# EasyEDA Pro project ProPrj_电容计量V2_2026-06-24.epro, schematic Schematic16_2
Board Name: Board1; Create Date: 2026-01-06; Page Name: P1; Project Name: 电容计量1; Schematic Name: Schematic5; Update Date: 2026-01-06; Page Size: A4; Version: V1.0
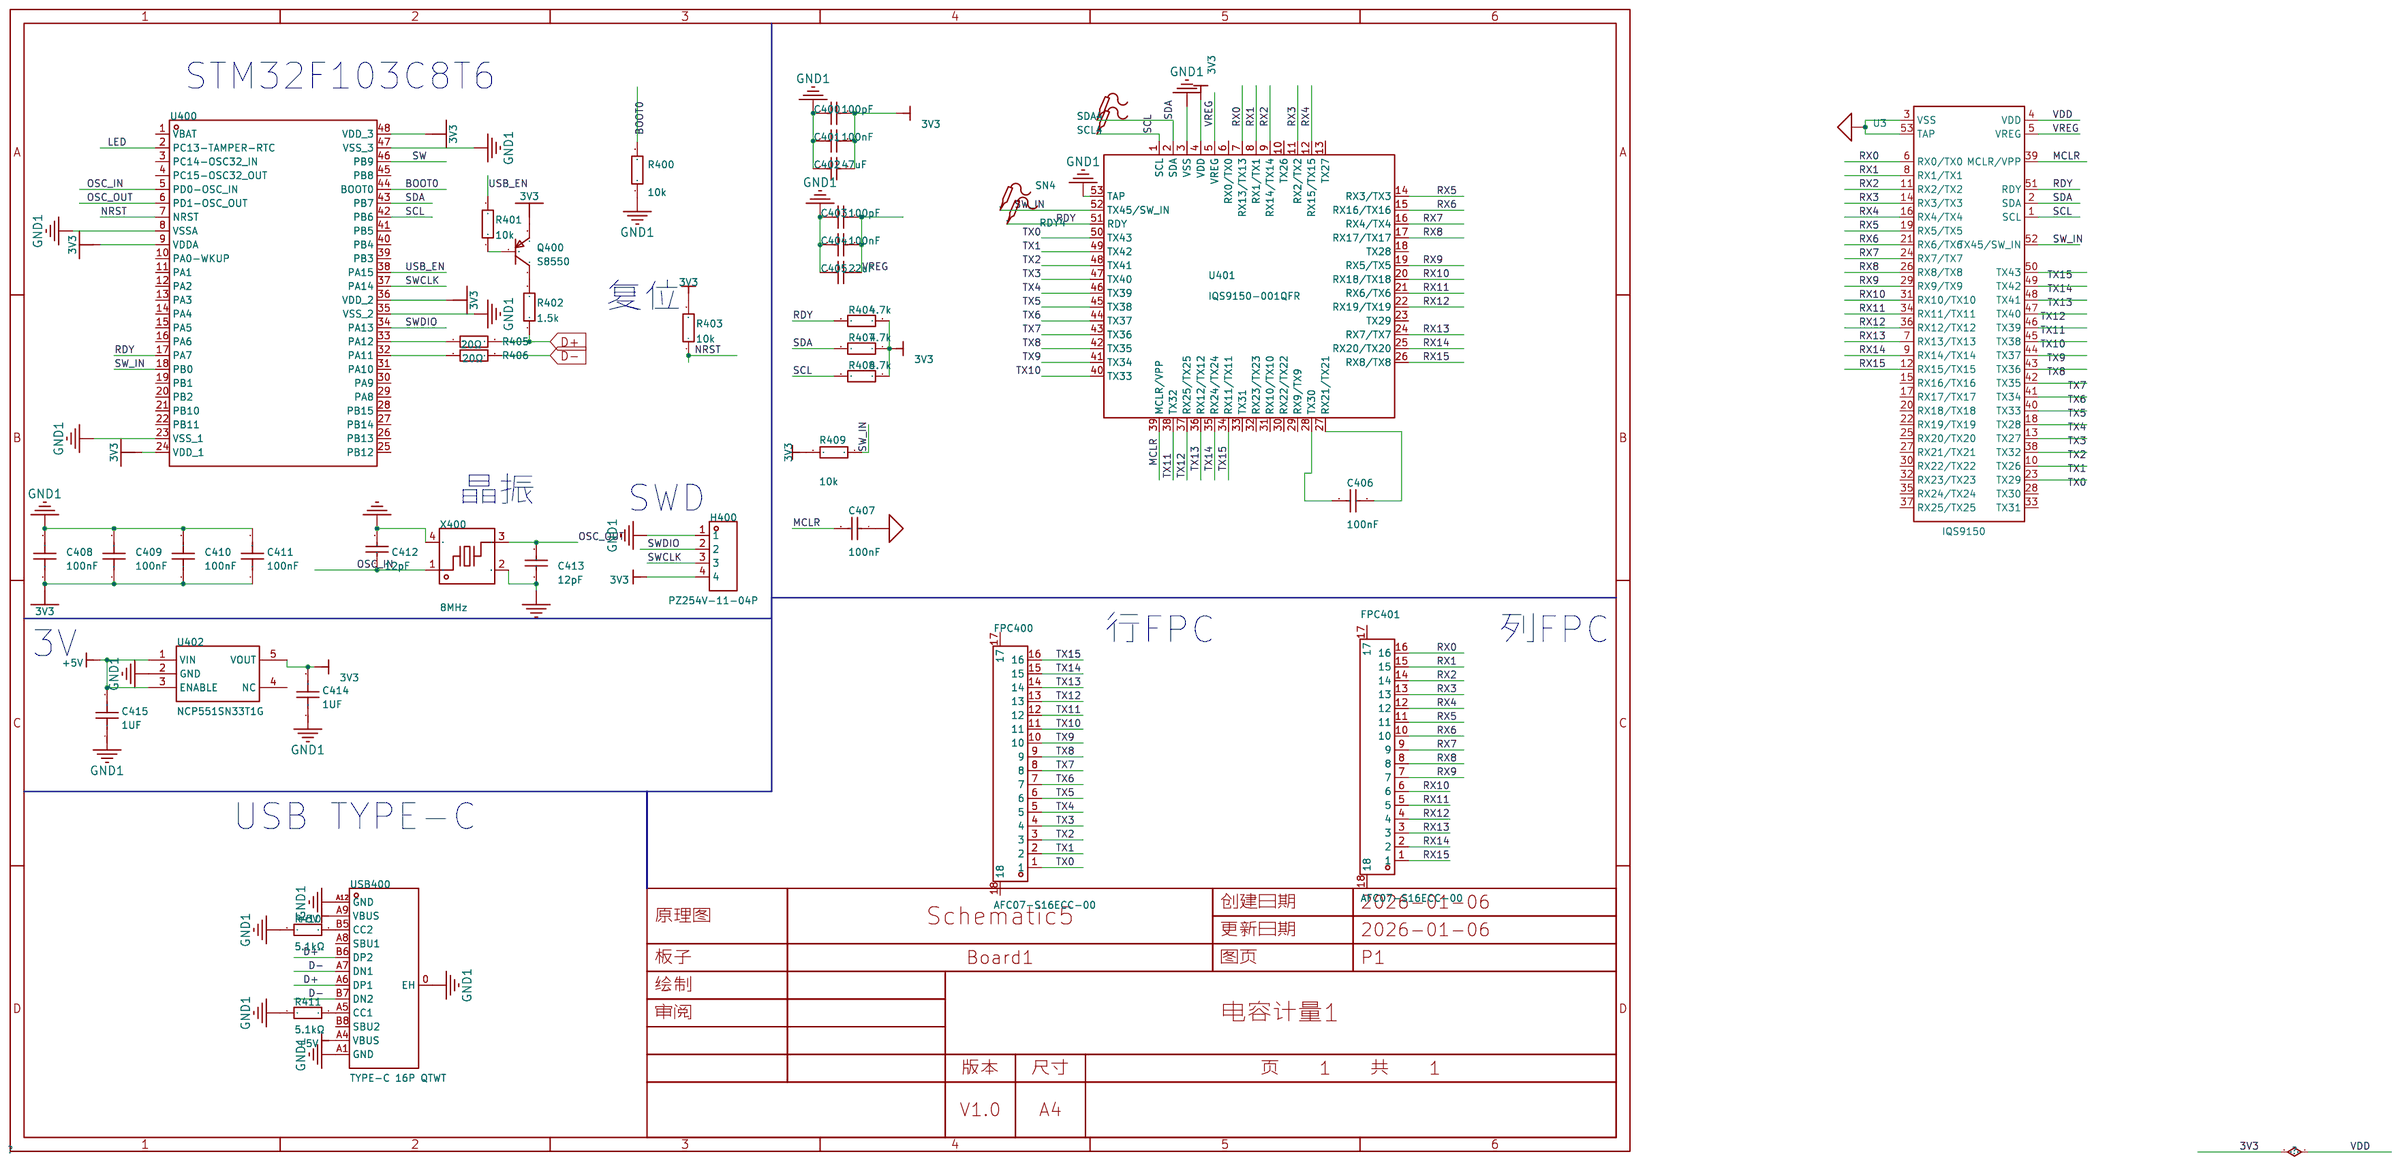
[diagram p6: schematic sheet]

## Parts
C400  100pF  [C0402]
C401  100nF  [C0402]
C402  47uF  [C0402]
C403  100pF  [C0402]
C404  100nF  [C0402]
C405  22uF  [C0402]
C406  100nF  [C0402]
C407  100nF  [C0402]
C408  100nF  [C0402]
C409  100nF  [C0402]
C410  100nF  [C0402]
C411  100nF  [C0402]
C412  12pF  [C0402]
C413  12pF  [C0402]
C414  1UF  [C0402]
C415  1UF  [C0402]
FPC400  AFC07-S16ECC-00  [FPC-SMD_16P-P0.50_AFC07-S16ECC-00]
FPC401  AFC07-S16ECC-00  [FPC-SMD_16P-P0.50_AFC07-S16ECC-00]
H400  PZ254V-11-04P  [HDR-TH_4P-P2.54-V-M]
Q400  S8550  [SOT-23-3_L2.9-W1.3-P1.90-LS2.4-BR]
R400  10k  [R0402]
R401  10k  [R0402]
R402  1.5k  [R0402]
R403  10k  [R0402]
R404  4.7k  [R0402]
R405  20Ω  [R0402]
R406  20Ω  [R0402]
R407  4.7k  [R0402]
R408  4.7k  [R0402]
R409  10k  [R0402]
R410  5.1kΩ  [R0402]
R411  5.1kΩ  [R0402]
RDY4  -  [Test-Point-0.5mm]
SCL4  -  [Test-Point-0.5mm]
SDA4  -  [Test-Point-0.5mm]
SN4  -  [Test-Point-0.5mm]
U3  IQS9150  [QFN1-52_L6.0-W6.0-P0.40-TL-EP4.5]
U400  -  [LQFP-48_L7.0-W7.0-P0.50-LS9.0-BL]
U401  IQS9150-001QFR  [QFN1-52_L6.0-W6.0-P0.40-TL-EP4.5]
U402  NCP551SN33T1G  [SOT-23-5_L3.0-W1.7-P0.95-LS2.8-BR]
USB400  TYPE-C 16P QTWT  [USB-TYPE-C-SMD_TYPE-C-16P-QTWT]
X400  8MHz  [CRYSTAL-SMD_4P-L3.2-W2.5-BL-1]

## Library data of the parts
C400-C407 C412 C413 = GCM1555C1H120FA16D: 容值:12pF;精度:±1%;额定电压:50V;材质(温度系数):C0G;; LCSC Part Name: 12pF ±1% 50V; Supplier Part: C393682; Manufacturer: muRata(村田); Supplier Footprint: 0402; JLCPCB Part Class: Extended Part; Datasheet: https://atta.szlcsc.com/upload/public/pdf/source/20190516/C393682_2405B7553F1D74F0F214F12B2CF6E34B.pdf; Supplier: LCSC; Tolerance: ±1%; Voltage Rated: 50V; Temperature Coefficient: C0G
C408-C411 C414 C415 = CC0402KRX7R7BB104: 容值:100nF;精度:±10%;额定电压:16V;温度系数:X7R;; LCSC Part Name: 100nF ±10% 16V; Supplier Part: C60474; Manufacturer: YAGEO(国巨); Supplier Footprint: 0402; JLCPCB Part Class: Extended Part; Datasheet: https://atta.szlcsc.com/upload/public/pdf/source/20211223/9278FD768280B81DDBEF48FA36411A03.pdf; Supplier: LCSC; Tolerance: ±10%; Voltage Rated: 16V; Temperature Coefficient: X7R
FPC400 FPC401 = AFC07-S16ECC-00: 锁定特性:抽屉式;触点类型:上接;触点数量:16P;间距:0.5mm;安装方式:卧贴;工作温度:-25℃~+85℃;; LCSC Part Name: 抽屉式 上接 P数:16P 间距:0.5mm; Supplier Part: C11088; Manufacturer: JS(钜硕电子); Supplier Footprint: SMD,P=0.5mm,卧贴; JLCPCB Part Class: Extended Part; Datasheet: https://item.szlcsc.com/datasheet/AFC07-S16ECC-00/11635.html; Supplier: LCSC; Locking Feature: 抽屉式; Contact Type: 上接; Number of Contacts: 16P; Pitch: 0.5mm; Mounting Type: 卧贴; FFC, FCB Thickness: 0.3mm; Height Above Board: 2mm; Contact Material: 磷青铜; Contact Plating: 锡; Operating Temperature: -25℃~+85℃; Rated Voltage (Max): 50V; Current Rating (Max): 400mA
H400 = PZ254V-11-04P: 插针结构:1x4P;间距:2.54mm;行距:-;圆针/方针:方针;安装方式:直插;排数:单排;总PIN位数:4P;额定电流:3A;额定电压:250V;配合针长度:6mm;塑高:2.5mm;端接针长度:3mm;触头材质:-;工作温度:-40℃~+105℃;颜色:黑色;; LCSC Part Name: 1x4P 间距:2.54mm 方针 直插; Supplier Part: C2691448; Manufacturer: XFCN(兴飞); Supplier Footprint: 插件,P=2.54mm; JLCPCB Part Class: 扩展库; Datasheet: https://item.szlcsc.com/datasheet/PZ254V-11-04P/2801085.html; Supplier: LCSC; Pin Structure: 1x4P; Pitch: 2.54mm; Circluar Pins/Square Pins: 方针; Mounting Type: 直插; Number of Rows: 单排; Number of Pins: 4P; Current Rating: 3A; Voltage Rating (Max): 250V; Length of Mating Pin: 6mm; Insulation Height: 2.5mm; Length of End Connection Pin: 3mm; Operating Temperature: -40℃~+105℃; Color: 黑色
Q400 = S8550: LCSC Part Name: PNP -25V -500mA 120-400 SOT-23; Supplier Part: C2931720; Manufacturer: Doeshare(德芯); Supplier Footprint: SOT-23; JLCPCB Part Class: 扩展库; Datasheet: https://atta.szlcsc.com/upload/public/pdf/source/20220104/15A23F6542E365B9E2BA018BE45092B6.pdf; Supplier: LCSC
R400-R404 R407-R409 = 0603WAF1002T5E: LCSC Part Name: 10KΩ(1002) ±1% 编带; Supplier Part: C25804; Manufacturer: UNI-ROYAL(厚声); Supplier Footprint: 0603; JLCPCB Part Class: Basic Part; Datasheet: https://atta.szlcsc.com/upload/public/pdf/source/20170920/C25804_1505901551523983377.pdf; Supplier: LCSC
R405 R406 = 0402WGJ0102TCE: 电阻类型:厚膜电阻;阻值:1kΩ;精度:±5%;功率:1/16W;温度系数:±100ppm/℃;最大工作电压:50V;工作温度范围:-55℃~+155℃;; LCSC Part Name: 1kΩ ±5%; Supplier Part: C25543; Manufacturer: UNI-ROYAL(厚声); Supplier Footprint: 0402; JLCPCB Part Class: Extended Part; Datasheet: https://atta.szlcsc.com/upload/public/pdf/source/20200306/C422600_1E6D84923E4A46A82E41ADD87F860B5C.pdf; Supplier: LCSC; Type: 厚膜电阻; Tolerance: ±5%; Power(Watts): 1/16W; Temperature Coefficient: ±100ppm/℃; Overload Voltage (Max): 50V; Operating Temperature Range: -55℃~+155℃
R410 R411 = 0805W8F5101T5E: 精度:±1%;温度系数:±100ppm/;阻值:5.1kΩ;功率:1/8W;最大工作电压:150V;工作温度范围:-55~+155;; LCSC Part Name: 5.1kΩ ±1%; Supplier Part: C27834; Manufacturer: UNI-ROYAL(厚声); Supplier Footprint: 0805; JLCPCB Part Class: 基础库; Datasheet: https://atta.szlcsc.com/upload/public/pdf/source/20170920/C27834_1505895234018981184.pdf; Supplier: LCSC; Tolerance: ±1%; Temperature Coefficient: ±100ppm/; Power(Watts): 1/8W; Overload Voltage (Max): 150V; Operating Temperature Range: -55~+155
RDY4 SCL4 SDA4 SN4 = Test-Point: Test Point 测试点
U3 U401 = IQS9150-001QFR: Supplier Part: C42000478; JLCPCB Part Class: Extended Part; Supplier: LCSC
U400 = STM32F103C8T6: 工作电压:2V ~ 3.6V;CPU位数:32-Bit;CPU内核:ARM- Cortex--M3;主频（MAX):72MHz;ROM类型:FLASH;; Supplier Part: C8734; Manufacturer: ST(意法半导体); Supplier Footprint: LQFP-48_7x7x05P; JLCPCB Part Class: Basic Part; Datasheet: https://atta.szlcsc.com/upload/public/pdf/source/20140724/1457707174202.pdf; Supplier: LCSC
U402 = NCP551SN33T1G: 输出类型:固定;最大输入电压:12V;输出电压:3.3V;最大输出电流:150mA;电源纹波抑制比(PSRR):-;输出极性:正极;; LCSC Part Name: 输入12V 输出3.3V 150mA; Supplier Part: C58434; Manufacturer: onsemi(安森美); Supplier Footprint: TSOP-5; JLCPCB Part Class: 扩展库; Datasheet: https://atta.szlcsc.com/upload/public/pdf/source/20150917/1457707389016.pdf; Supplier: LCSC; Output Type: 固定; Maximum Input Voltage: 12V; Output Voltage: 3.3V; MAX Output Current: 150mA; Dropout Voltage: 150mV@(10mA); standby current: 8uA; Operating Temperature: -40℃~+85℃; Output Polarity: 正极; Number of Outputs: 1
USB400 = TYPE-C 16P QTWT: 连接器类型:Type-C;协议标准:USB 3.1;公母:母;安装方式:卧贴;触点数量:16P;端口数量:1;额定电流 - 电源:3A;工作温度:-25℃~+85℃;; LCSC Part Name: Type-C 母 卧贴; Supplier Part: C5187472; Manufacturer: SHOU HAN(首韩); Supplier Footprint: SMD; JLCPCB Part Class: Extended Part; Datasheet: https://item.szlcsc.com/datasheet/TYPE-C%252016P%2520QTWT/5860367.html; Supplier: LCSC; Connector Type: Type-C; Protocol Standard: USB 3.1; Gender: 母; Mounting Type: 卧贴; Number of Contacts: 16P; Number of Ports: 1; Current Rating-Power: 3A; Voltage Rating: 5V; Connect-Disconnect Life: 5千次; Detection color: 黑色; Operating Temperature: -25℃~+85℃
X400 = XL2EL89COI-111YLC-8M: 晶振类型:贴片晶振;频率:8MHz;常温频差:±10ppm;外接负载电容:12pF;频率稳定度(全温):±20ppm;; LCSC Part Name: 8MHz ±10ppm 12pF; Supplier Part: C2973805; Manufacturer: YXC(扬兴晶振); Supplier Footprint: SMD3225-4P; JLCPCB Part Class: 扩展库; Datasheet: https://atta.szlcsc.com/upload/public/pdf/source/20240329/19D5F850207469550BEB00D7DFEDBC7A.pdf; Supplier: LCSC; Crystal Type: 贴片晶振; Normal temperature Frequency Tolerance: ±10ppm; External load capacitor: 12pF; Frequency Stability(Full temperature range): ±20ppm; Equivalent Series Resistance (ESR): 150Ω; Operating Temperature: -40℃~+85℃

## Nets
3V3: C400.1 C401.1 C402.1 C408.1 C409.1 C410.1 C411.1 C414.2 H400.4 Q400.2(E) R403.2 R404.1 R407.1 R408.1 R409.2 U3.4(VDD) U400.9(VDDA) U400.24(VDD_1) U400.36(VDD_2) U400.48(VDD_3) U401.4(VDD) U402.5(VOUT)
+5V: C415.2 U402.1(VIN) U402.3(ENABLE) USB400.A4(VBUS) USB400.A9(VBUS)
GND1: C400.2 C401.2 C402.2 C403.2 C404.2 C405.2 C407.1 C408.2 C409.2 C410.2 C411.2 C412.2 C413.1 C414.1 C415.1 H400.1 R400.1 R410.2 R411.2 U3.3(VSS) U3.53(TAP) U400.8(VSSA) U400.23(VSS_1) U400.35(VSS_2) U400.47(VSS_3) U401.3(VSS) U401.53(TAP) U402.2(GND) USB400.0(EH) USB400.A1(GND) USB400.A12(GND) X400.2(GND) X400.4(GND)
BOOT0: R400.2 U400.44(BOOT0)
D+: R402.1 R405.2 USB400.A6(DP1) USB400.B6(DP2)
D-: R406.2 USB400.A7(DN1) USB400.B7(DN2)
LED: U400.2(PC13-TAMPER-RTC)
MCLR: C407.2 U3.39(MCLR/VPP) U401.39(MCLR/VPP)
NRST: R403.1 U400.7(NRST)
OSC_IN: C412.1 U400.5(PD0-OSC_IN) X400.1
OSC_OUT: C413.2 U400.6(PD1-OSC_OUT) X400.3
RDY: R404.2 RDY4.1 U3.51(RDY) U400.17(PA7) U401.51(RDY)
RX0: FPC401.16 U3.6(RX0/TX0) U401.7(RX13/TX13)
RX1: FPC401.15 U3.8(RX1/TX1) U401.8(RX1/TX1)
RX2: FPC401.14 U3.11(RX2/TX2) U401.9(RX14/TX14)
RX3: FPC401.13 U3.14(RX3/TX3) U401.11(RX2/TX2)
RX4: FPC401.12 U3.16(RX4/TX4) U401.12(RX15/TX15)
RX5: FPC401.11 U3.19(RX5/TX5) U401.14(RX3/TX3)
RX6: FPC401.10 U3.21(RX6/TX6) U401.15(RX16/TX16)
RX7: FPC401.9 U3.24(RX7/TX7) U401.16(RX4/TX4)
RX8: FPC401.8 U3.26(RX8/TX8) U401.17(RX17/TX17)
RX9: FPC401.7 U3.29(RX9/TX9) U401.19(RX5/TX5)
RX10: FPC401.6 U3.31(RX10/TX10) U401.20(RX18/TX18)
RX11: FPC401.5 U3.34(RX11/TX11) U401.21(RX6/TX6)
RX12: FPC401.4 U3.36(RX12/TX12) U401.22(RX19/TX19)
RX13: FPC401.3 U3.7(RX13/TX13) U401.24(RX7/TX7)
RX14: FPC401.2 U3.9(RX14/TX14) U401.25(RX20/TX20)
RX15: FPC401.1 U3.12(RX15/TX15) U401.26(RX8/TX8)
SCL: R408.2 SCL4.1 U3.1(SCL) U400.42(PB6) U401.1(SCL)
SDA: R407.2 SDA4.1 U3.2(SDA) U400.43(PB7) U401.2(SDA)
SW: U400.46(PB9)
SW_IN: R409.1 SN4.1 U3.52(TX45/SW_IN) U400.18(PB0) U401.52(TX45/SW_IN)
SWCLK: H400.3 U400.37(PA14)
SWDIO: H400.2 U400.34(PA13)
TX0: FPC400.1 U3.23(TX29) U401.50(TX43)
TX1: FPC400.2 U3.10(TX26) U401.49(TX42)
TX2: FPC400.3 U3.38(TX32) U401.48(TX41)
TX3: FPC400.4 U3.13(TX27) U401.47(TX40)
TX4: FPC400.5 U3.18(TX28) U401.46(TX39)
TX5: FPC400.6 U3.40(TX33) U401.45(TX38)
TX6: FPC400.7 U3.41(TX34) U401.44(TX37)
TX7: FPC400.8 U3.42(TX35) U401.43(TX36)
TX8: FPC400.9 U3.43(TX36) U401.42(TX35)
TX9: FPC400.10 U3.44(TX37) U401.41(TX34)
TX10: FPC400.11 U3.45(TX38) U401.40(TX33)
TX11: FPC400.12 U3.46(TX39) U401.38(TX32)
TX12: FPC400.13 U3.47(TX40) U401.37(RX25/TX25)
TX13: FPC400.14 U3.48(TX41) U401.36(RX12/TX12)
TX14: FPC400.15 U3.49(TX42) U401.35(RX24/TX24)
TX15: FPC400.16 U3.50(TX43) U401.34(RX11/TX11)
USB_EN: R401.2 U400.38(PA15)
VREG: C403.1 C404.1 C405.1 U3.5(VREG) U401.5(VREG)
$1N12: R411.1 USB400.A5(CC1)
$1N14: R410.1 USB400.B5(CC2)
$1N194: Q400.1(B) R401.1
$1N196: Q400.3(C) R402.2
$1N212: R405.1 U400.33(PA12)
$1N232: R406.1 U400.32(PA11)
$1N481: C406.2 U401.28(TX30)
$1N482: C406.1 U401.27(RX21/TX21)

Not connected (* = marked no-connect by the designer): FPC400 17 18; FPC401 17 18; U3 15(RX16/TX16) 17(RX17/TX17) 20(RX18/TX18) 22(RX19/TX19) 25(RX20/TX20) 27(RX21/TX21) 28(TX30) 30(RX22/TX22) 32(RX23/TX23) 33(TX31) 35(RX24/TX24) 37(RX25/TX25); U400 1(VBAT) 3(PC14-OSC32_IN) 4(PC15-OSC32_OUT) 10(PA0-WKUP) 11(PA1) 12(PA2) 13(PA3) 14(PA4) 15(PA5) 16(PA6) 19(PB1) 20(PB2) 21(PB10) 22(PB11) 25(PB12) 26(PB13) 27(PB14) 28(PB15) 29(PA8) 30(PA9) 31(PA10) 39(PB3) 40(PB4) 41(PB5) 45(PB8); U401 6(RX0/TX0) 10(TX26) 13(TX27) 18(TX28) 23(TX29) 29(RX9/TX9) 30(RX22/TX22) 31(RX10/TX10) 32(RX23/TX23) 33(TX31); U402 4(NC); USB400 A8(SBU1) B8(SBU2)

## Notes on the sheet
- STM32F103C8T6
- 复位
- 晶振
- SWD
- 行FPC
- 列FPC
- 3V
- USB TYPE-C
